# Altium schematic sheet 0-OverView.SCHDOC
size A4
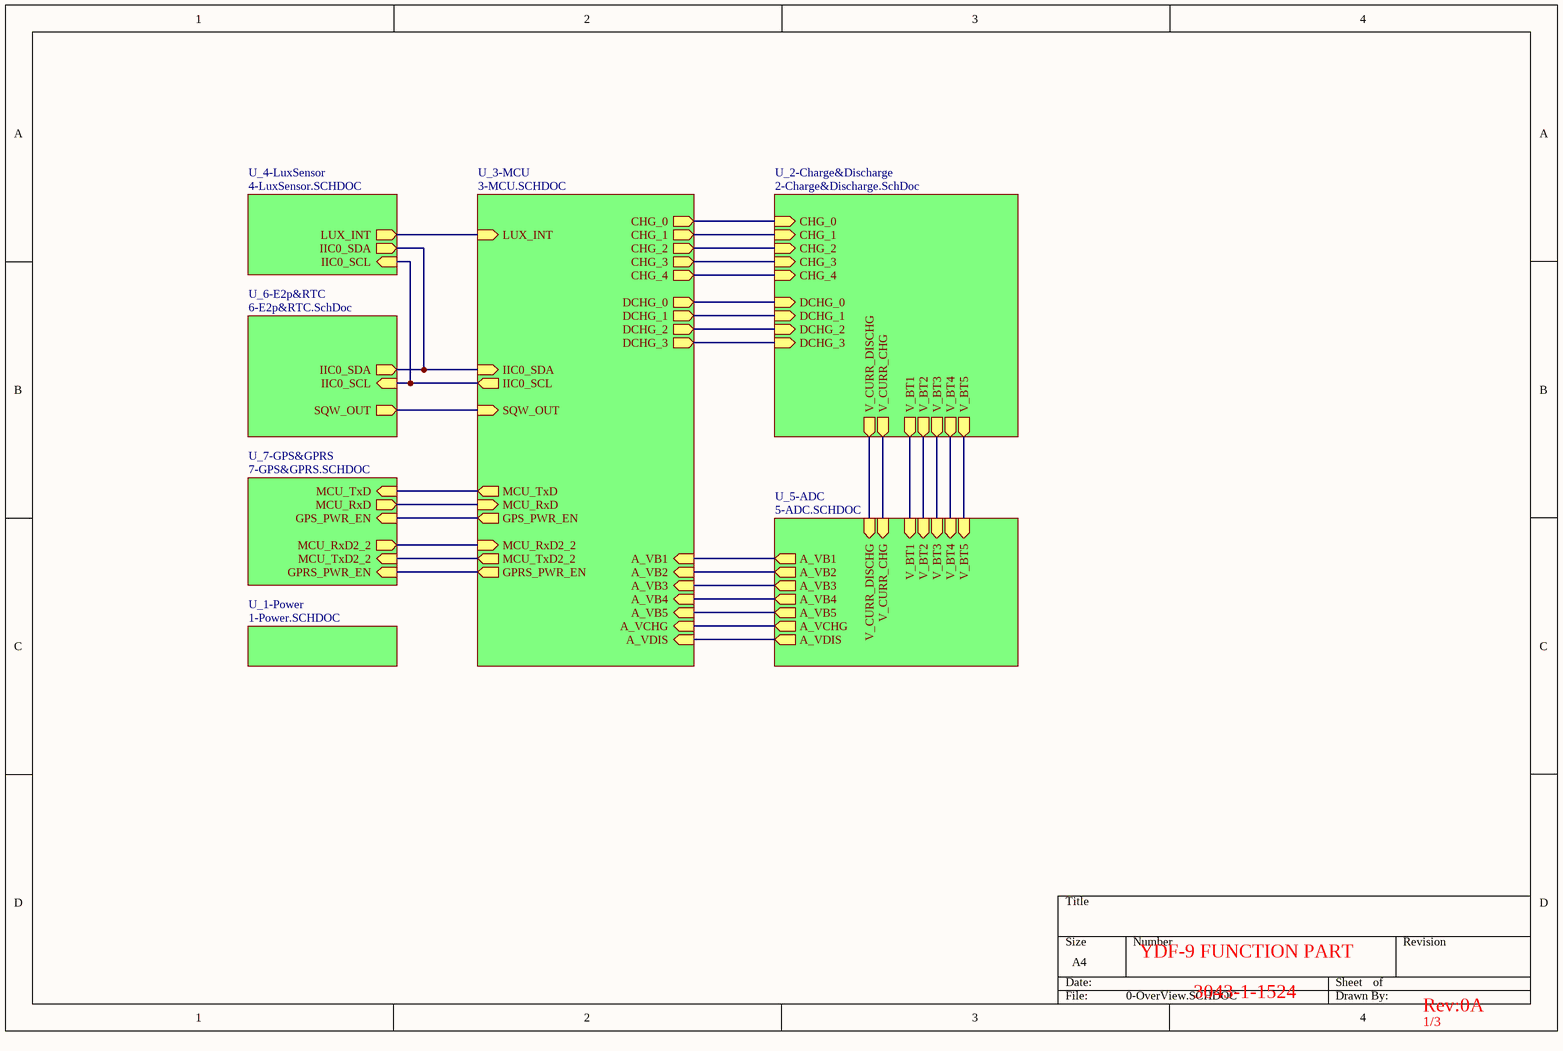
[diagram p0: 0-OverView.SCHDOC]

## Sub-sheets
U_1-Power = 1-Power.SCHDOC: no entries
U_2-Charge&Discharge = 2-Charge&Discharge.SchDoc: V_BT1 (out), V_BT2 (out), V_BT3 (out), V_BT4 (out), V_BT5 (out), V_CURR_CHG (out), V_CURR_DISCHG (out), CHG_2 (in), CHG_3 (in), DCHG_0 (in), CHG_4 (in), CHG_0 (in), DCHG_1 (in), CHG_1 (in), DCHG_2 (in), DCHG_3 (in)
U_3-MCU = 3-MCU.SCHDOC: IIC0_SDA (in), IIC0_SCL (out), SQW_OUT (in), A_VDIS (in), A_VB5 (in), A_VCHG (in), A_VB1 (in), A_VB4 (in), A_VB2 (in), A_VB3 (in), GPRS_PWR_EN (out), MCU_RxD2_2 (in), GPS_PWR_EN (out), MCU_TxD2_2 (out), MCU_RxD (in), CHG_3 (out), CHG_4 (out), CHG_0 (out), CHG_1 (out), CHG_2 (out), DCHG_0 (out), DCHG_1 (out), DCHG_2 (out), DCHG_3 (out), LUX_INT (in), MCU_TxD (out)
U_4-LuxSensor = 4-LuxSensor.SCHDOC: IIC0_SCL (in), IIC0_SDA (out), LUX_INT (out)
U_5-ADC = 5-ADC.SCHDOC: V_BT5 (in), V_BT3 (in), V_BT2 (in), V_BT4 (in), V_BT1 (in), A_VDIS (out), A_VB3 (out), A_VB5 (out), A_VB1 (out), A_VB4 (out), A_VCHG (out), A_VB2 (out), V_CURR_DISCHG (in), V_CURR_CHG (in)
U_6-E2p&RTC = 6-E2p&RTC.SchDoc: IIC0_SCL (in), IIC0_SDA (out), SQW_OUT (out)
U_7-GPS&GPRS = 7-GPS&GPRS.SCHDOC: GPS_PWR_EN (in), MCU_RxD (out), MCU_TxD2_2 (in), GPRS_PWR_EN (in), MCU_RxD2_2 (out), MCU_TxD (in)

## Nets
(unnamed): sheet U_2-Charge&Discharge/V_BT1, sheet U_5-ADC/V_BT1
(unnamed): sheet U_2-Charge&Discharge/V_BT2, sheet U_5-ADC/V_BT2
(unnamed): sheet U_2-Charge&Discharge/V_BT3, sheet U_5-ADC/V_BT3
(unnamed): sheet U_2-Charge&Discharge/V_BT4, sheet U_5-ADC/V_BT4
(unnamed): sheet U_2-Charge&Discharge/V_BT5, sheet U_5-ADC/V_BT5
(unnamed): sheet U_2-Charge&Discharge/V_CURR_CHG, sheet U_5-ADC/V_CURR_CHG
(unnamed): sheet U_2-Charge&Discharge/V_CURR_DISCHG, sheet U_5-ADC/V_CURR_DISCHG
(unnamed): sheet U_2-Charge&Discharge/CHG_2, sheet U_3-MCU/CHG_2
(unnamed): sheet U_2-Charge&Discharge/CHG_3, sheet U_3-MCU/CHG_3
(unnamed): sheet U_2-Charge&Discharge/DCHG_0, sheet U_3-MCU/DCHG_0
(unnamed): sheet U_2-Charge&Discharge/CHG_4, sheet U_3-MCU/CHG_4
(unnamed): sheet U_2-Charge&Discharge/CHG_0, sheet U_3-MCU/CHG_0
(unnamed): sheet U_2-Charge&Discharge/DCHG_1, sheet U_3-MCU/DCHG_1
(unnamed): sheet U_2-Charge&Discharge/CHG_1, sheet U_3-MCU/CHG_1
(unnamed): sheet U_2-Charge&Discharge/DCHG_2, sheet U_3-MCU/DCHG_2
(unnamed): sheet U_2-Charge&Discharge/DCHG_3, sheet U_3-MCU/DCHG_3
(unnamed): sheet U_3-MCU/IIC0_SDA, sheet U_6-E2p&RTC/IIC0_SDA, sheet U_4-LuxSensor/IIC0_SDA
(unnamed): sheet U_3-MCU/IIC0_SCL, sheet U_6-E2p&RTC/IIC0_SCL, sheet U_4-LuxSensor/IIC0_SCL
(unnamed): sheet U_3-MCU/SQW_OUT, sheet U_6-E2p&RTC/SQW_OUT
(unnamed): sheet U_3-MCU/A_VDIS, sheet U_5-ADC/A_VDIS
(unnamed): sheet U_3-MCU/A_VB5, sheet U_5-ADC/A_VB5
(unnamed): sheet U_3-MCU/A_VCHG, sheet U_5-ADC/A_VCHG
(unnamed): sheet U_3-MCU/A_VB1, sheet U_5-ADC/A_VB1
(unnamed): sheet U_3-MCU/A_VB4, sheet U_5-ADC/A_VB4
(unnamed): sheet U_3-MCU/A_VB2, sheet U_5-ADC/A_VB2
(unnamed): sheet U_3-MCU/A_VB3, sheet U_5-ADC/A_VB3
(unnamed): sheet U_3-MCU/GPRS_PWR_EN, sheet U_7-GPS&GPRS/GPRS_PWR_EN
(unnamed): sheet U_3-MCU/MCU_RxD2_2, sheet U_7-GPS&GPRS/MCU_RxD2_2
(unnamed): sheet U_3-MCU/GPS_PWR_EN, sheet U_7-GPS&GPRS/GPS_PWR_EN
(unnamed): sheet U_3-MCU/MCU_TxD2_2, sheet U_7-GPS&GPRS/MCU_TxD2_2
(unnamed): sheet U_3-MCU/MCU_RxD, sheet U_7-GPS&GPRS/MCU_RxD
(unnamed): sheet U_3-MCU/LUX_INT, sheet U_4-LuxSensor/LUX_INT
(unnamed): sheet U_3-MCU/MCU_TxD, sheet U_7-GPS&GPRS/MCU_TxD

## Notes on the sheet
- YDF-9 FUNCTION PART
- 3043-1-1524
- Rev:0A
- 1/3